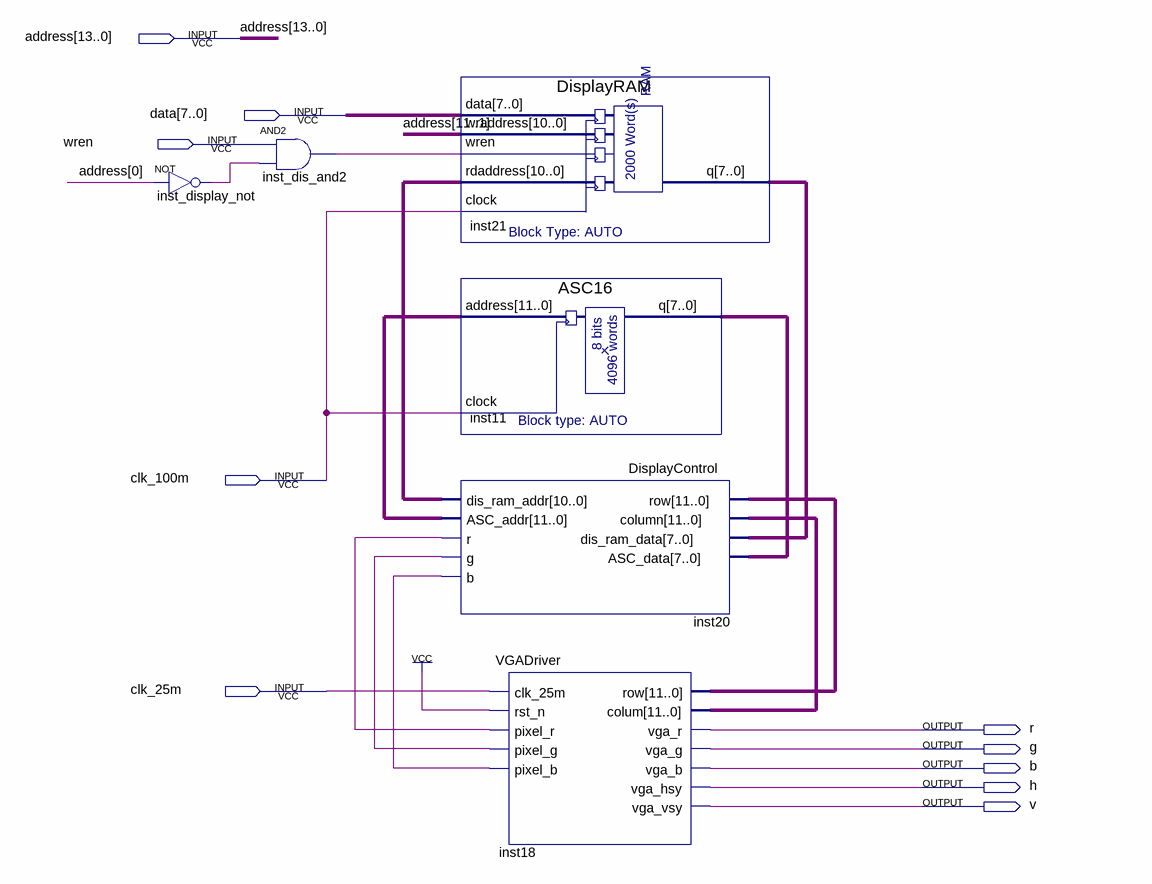
[diagram p0: schematic sheet]
// Quartus schematic DisplayCard.bdf as structural Verilog: 6 symbols, 10 pins
module DisplayCard (
  input  [13:0] address,
  input  [7:0] data,
  input  wren,
  input  clk_100m,
  input  clk_25m,
  output r,
  output g,
  output b,
  output h,
  output v
);

  wire inst20_b, inst20_g, inst20_r, inst_dis_and2_out, inst_display_not_out;
  wire [7:0] inst11_q, inst21_q;
  wire [10:0] inst20_dis_ram_addr;
  wire [11:0] inst18_colum, inst18_row, inst20_asc_addr;

  not inst_display_not (inst_display_not_out, address[0]);
  and inst_dis_and2 (inst_dis_and2_out, wren, inst_display_not_out);
  DisplayRAM inst21 (
    .data(data), .wraddress(address[11:1]), .wren(inst_dis_and2_out), .rdaddress(inst20_dis_ram_addr),
    .clock(clk_100m), .q(inst21_q));
  ASC16 inst11 (.address(inst20_asc_addr), .clock(clk_100m), .q(inst11_q));
  DisplayControl inst20 (
    .row(inst18_row), .column(inst18_colum), .dis_ram_data(inst21_q), .ASC_data(inst11_q),
    .dis_ram_addr(inst20_dis_ram_addr), .ASC_addr(inst20_asc_addr), .r(inst20_r), .g(inst20_g), .b(inst20_b));
  VGADriver inst18 (
    .clk_25m(clk_25m), .rst_n(1'b1), .pixel_r(inst20_r), .pixel_g(inst20_g), .pixel_b(inst20_b),
    .row(inst18_row), .colum(inst18_colum), .vga_r(r), .vga_g(g), .vga_b(b), .vga_hsy(h), .vga_vsy(v));
endmodule
